# EAGLE schematic PB1_LTC2400_DAQ (EAGLE 7.4.0)
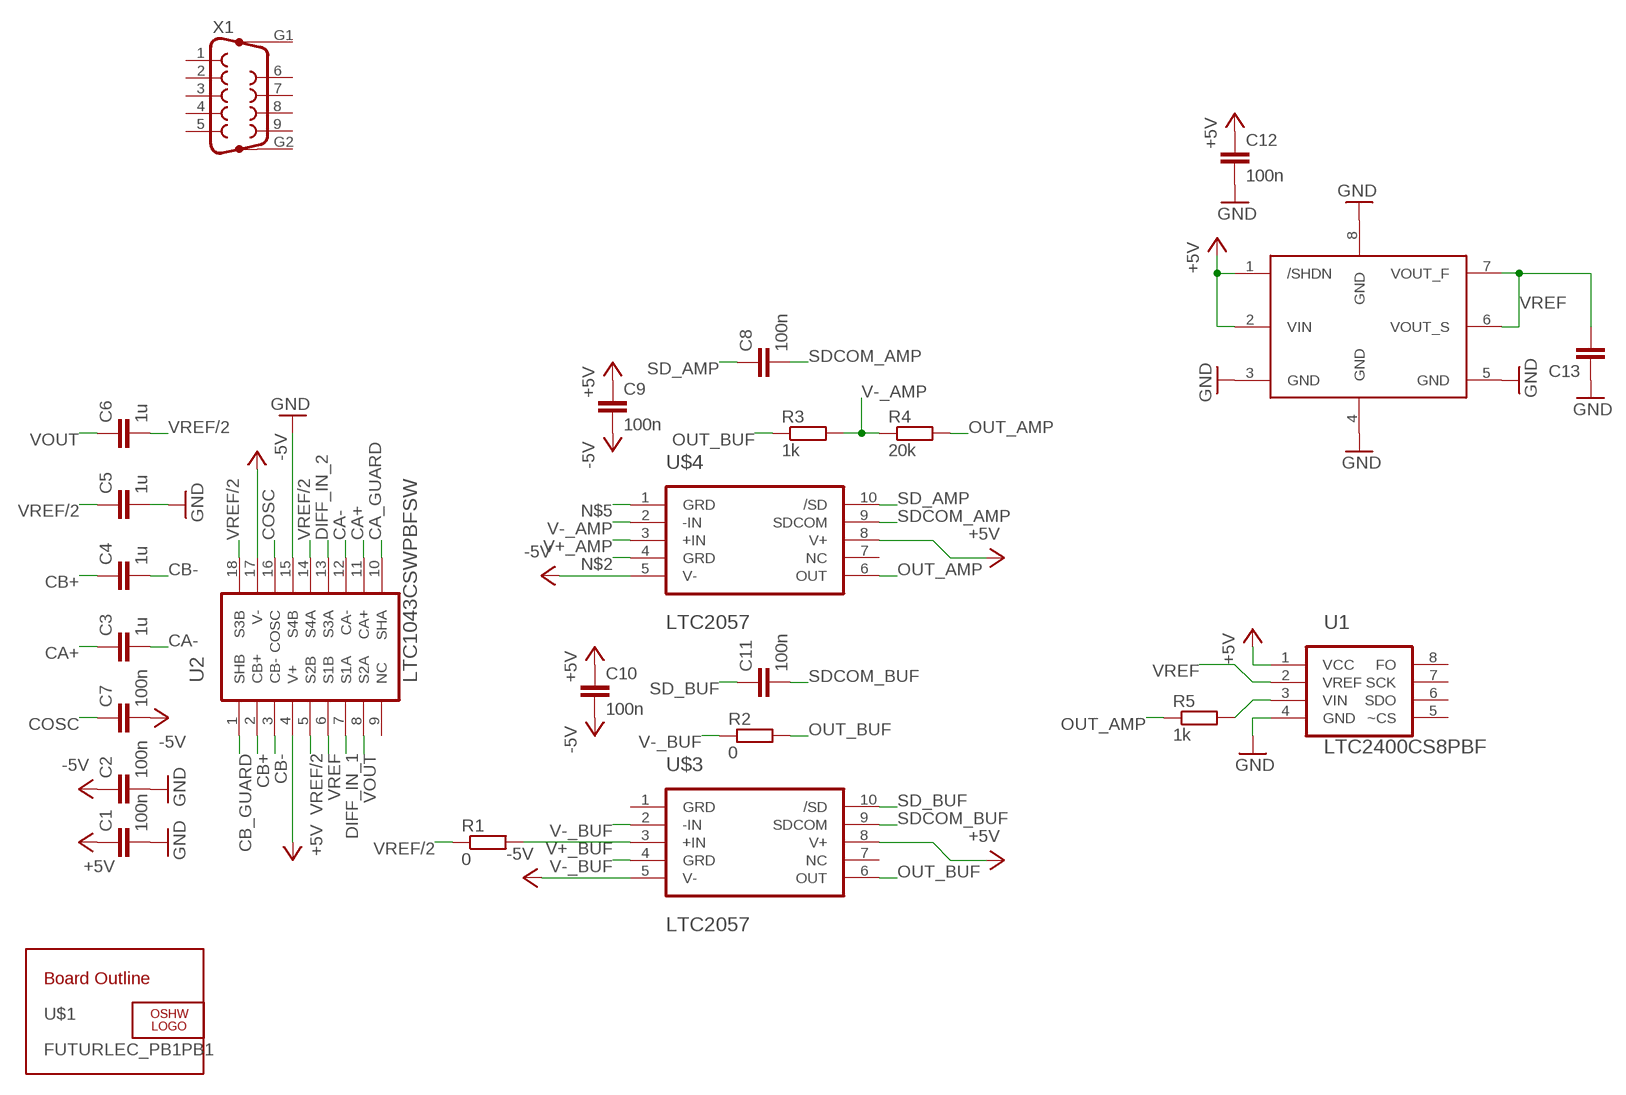
[diagram p0: schematic, sheet 1]

## Parts
C1  100n  C-EUC1812K  [C1812K]
C2  100n  C-EUC1812K  [C1812K]
C3  1u  C-EUC2220K  [C2220K]
C4  1u  C-EUC2220K  [C2220K]
C5  1u  C-EUC2220K  [C2220K]
C6  1u  C-EUC2220K  [C2220K]
C7  100n  C-EUC1812K  [C1812K]
C8  100n  C-EUC0603  [C0603]
C9  100n  C-EUC1812K  [C1812K]
C10  100n  C-EUC1812K  [C1812K]
C11  100n  C-EUC0603  [C0603]
C12  100n  C-EUC1812K  [C1812K]
C13  C-EU075-063X106  [C075-063X106]
LOGO1  OSHW_LOGO_8MILX0200-NT  [OSHW_8X200_NOTEXT]
R1  0  R-EU_R0805  [R0805]
R2  0  R-EU_R0805  [R0805]
R3  1k  R-EU_R0805  [R0805]
R4  20k  R-EU_R0805  [R0805]
R5  1k  R-EU_R0805  [R0805]
U1  LTC2400CS8PBF  [SOIC127P600X175-8N]
U2  LTC1043CSWPBFSW  [SOIC127P1032X264-18N]
U$1  FUTURLEC_PB1PB1  [FUTURLEC_PB1]
U$2  LTC6655LS8_ELONG  [LS8_ELONG]
U$3  LTC2057  [MS-MSOP10]
U$4  LTC2057  [MS-MSOP10]
X1  F09VP  [F09VP]

## Nets
+5V: C1.1 C9.1 C10.1 C12.1 U1.1(VCC) U2.4(V+) U$2.1(/SHDN) U$2.2(VIN) U$3.8(V+) U$4.8(V+)
-5V: C2.1 C7.2 C9.2 C10.2 U2.17(V-) U$3.5(V-) U$4.5(V-)
CA+: C3.1 U2.11(CA+)
CA-: C3.2 U2.12(CA-)
CA_GUARD: U2.10(SHA)
CB+: C4.1 U2.2(CB+)
CB-: C4.2 U2.3(CB-)
CB_GUARD: U2.1(SHB)
COSC: C7.1 U2.16(COSC)
DIFF_IN_1: U2.7(S1A)
DIFF_IN_2: U2.13(S3A)
GND: C1.2 C2.2 C5.2 C12.2 C13.1 U1.4(GND) U2.15(S4B) U$2.3(GND) U$2.4(GND) U$2.5(GND) U$2.8(GND)
N$1: R5.2 U1.3(VIN)
N$2: U$4.4(GRD)
N$5: U$4.1(GRD)
OUT_AMP: R4.2 R5.1 U$4.6(OUT)
OUT_BUF: R2.2 R3.1 U$3.6(OUT)
SD_AMP: C8.1 U$4.10(/SD)
SD_BUF: C11.1 U$3.10(/SD)
SDCOM_AMP: C8.2 U$4.9(SDCOM)
SDCOM_BUF: C11.2 U$3.9(SDCOM)
V+_AMP: U$4.3(+IN)
V+_BUF: R1.2 U$3.3(+IN)
V-_AMP: R3.2 R4.1 U$4.2(-IN)
V-_BUF: R2.1 U$3.2(-IN) U$3.4(GRD)
VOUT: C6.1 U2.8(S2A)
VREF: C13.2 U1.2(VREF) U2.6(S1B) U$2.6(VOUT_S) U$2.7(VOUT_F)
VREF/2: C5.1 C6.2 R1.1 U2.5(S2B) U2.14(S4A) U2.18(S3B)
Unconnected: U1.5(~CS) U1.6(SDO) U1.7(SCK) U1.8(FO) U2.9(NC) U$3.1(GRD) U$3.7(NC) U$4.7(NC) X1.1 X1.2 X1.3 X1.4 X1.5 X1.6 X1.7 X1.8 X1.9 X1.G1 X1.G2

## Library data of the parts
C1-C13 = SquantorRCL:C-EU: CAPACITOR, European symbol
LOGO1 = ohw-logo:OSHW_LOGO_8MIL
R1-R5 = SquantorRCL:R-EU_: RESISTOR, European symbol
U1 = SquantorLinearTechnology:LTC2400CS8PBF: ADC; MPN: LTC2400CS8#PBF; OC_FARNELL: 1663682; OC_NEWARK: 56M5400; PACKAGE: SOIC-8; SUPPLIER: Linear Technology
U2 = SquantorLinearTechnology:LTC1043CSWPBF: Dual Precision Instrumentation Switched Capacitor Building Block; MPN: LTC1043CSW#PBF; OC_FARNELL: 1663591; OC_NEWARK: 55M8881; PACKAGE: SOIC-18; SUPPLIER: Linear Technology
U$1 = SquantorPCBOutline:FUTURLEC_PB1
U$2 = SquantorLinearTechnology:LTC6655
U$3 U$4 = SquantorLinearTechnology:LTC2057
X1 = con-subd:F09VP: SUB-D; OC_FARNELL: unknown; OC_NEWARK: unknown